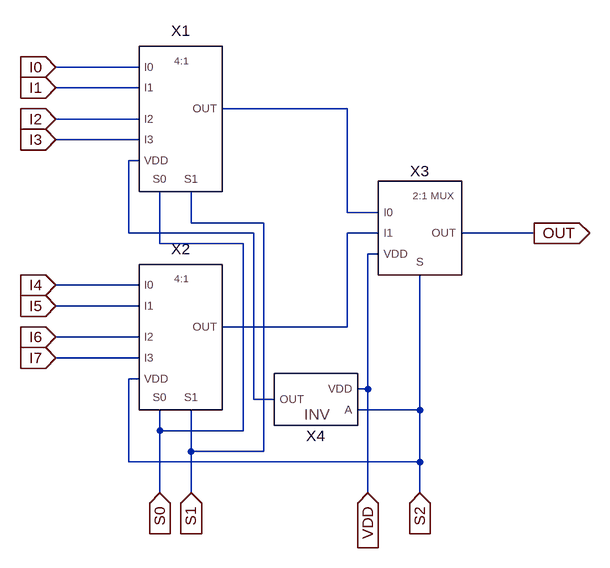
[diagram p0: schematic MUX8to1.asc]
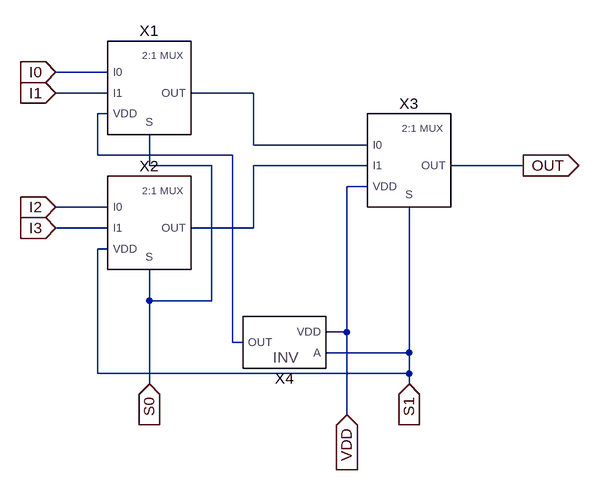
[diagram p1: sub-circuit mux4to1.asc]
MUX8to1.asc, the LTspice schematic file:
Version 4
SHEET 1 880 812
WIRE 112 48 -16 48
WIRE 112 80 -16 80
WIRE 432 112 240 112
WIRE 112 128 -16 128
WIRE 112 160 -16 160
WIRE 112 192 96 192
WIRE 432 272 432 112
WIRE 480 272 432 272
WIRE 192 288 192 240
WIRE 304 288 192 288
WIRE 96 304 96 192
WIRE 288 304 96 304
WIRE 480 304 432 304
WIRE 720 304 608 304
WIRE 144 320 144 240
WIRE 272 320 144 320
WIRE 480 336 464 336
WIRE 112 384 -16 384
WIRE 112 416 -16 416
WIRE 432 448 432 304
WIRE 432 448 240 448
WIRE 112 464 -16 464
WIRE 112 496 -16 496
WIRE 112 528 96 528
WIRE 464 544 464 336
WIRE 464 544 448 544
WIRE 288 560 288 304
WIRE 320 560 288 560
WIRE 544 576 544 368
WIRE 544 576 448 576
WIRE 144 608 144 576
WIRE 272 608 272 320
WIRE 272 608 144 608
WIRE 192 640 192 576
WIRE 304 640 304 288
WIRE 304 640 192 640
WIRE 96 656 96 528
WIRE 544 656 544 576
WIRE 544 656 96 656
WIRE 144 704 144 608
WIRE 192 704 192 640
WIRE 464 704 464 544
WIRE 544 704 544 656
FLAG -16 48 I0
IOPIN -16 48 In
FLAG -16 80 I1
IOPIN -16 80 In
FLAG -16 128 I2
IOPIN -16 128 In
FLAG -16 160 I3
IOPIN -16 160 In
FLAG -16 384 I4
IOPIN -16 384 In
FLAG -16 416 I5
IOPIN -16 416 In
FLAG -16 464 I6
IOPIN -16 464 In
FLAG -16 496 I7
IOPIN -16 496 In
FLAG 144 704 S0
IOPIN 144 704 In
FLAG 192 704 S1
IOPIN 192 704 In
FLAG 544 704 S2
IOPIN 544 704 In
FLAG 464 704 VDD
IOPIN 464 704 In
FLAG 720 304 OUT
IOPIN 720 304 Out
SYMBOL MUX4to1 176 128 R0
SYMATTR InstName X1
SYMBOL MUX4to1 176 464 R0
SYMATTR InstName X2
SYMBOL MUX2to1 544 304 R0
SYMATTR InstName X3
SYMBOL INVgdi 384 560 R180
SYMATTR InstName X4

mux4to1.asc, the sub-circuit schematic file:
Version 4
SHEET 1 880 684
WIRE 96 48 16 48
WIRE 96 80 16 80
WIRE 320 80 224 80
WIRE 96 112 80 112
WIRE 320 160 320 80
WIRE 496 160 320 160
WIRE 80 176 80 112
WIRE 288 176 80 176
WIRE 160 192 160 144
WIRE 256 192 160 192
WIRE 496 192 320 192
WIRE 736 192 624 192
WIRE 496 224 464 224
WIRE 96 256 16 256
WIRE 96 288 16 288
WIRE 320 288 320 192
WIRE 320 288 224 288
WIRE 96 320 80 320
WIRE 160 400 160 352
WIRE 256 400 256 192
WIRE 256 400 160 400
WIRE 464 448 464 224
WIRE 464 448 432 448
WIRE 288 464 288 176
WIRE 304 464 288 464
WIRE 560 480 560 256
WIRE 560 480 432 480
WIRE 80 512 80 320
WIRE 560 512 560 480
WIRE 560 512 80 512
WIRE 160 528 160 400
WIRE 560 528 560 512
WIRE 464 576 464 448
FLAG 16 48 I0
IOPIN 16 48 In
FLAG 16 80 I1
IOPIN 16 80 In
FLAG 16 256 I2
IOPIN 16 256 In
FLAG 16 288 I3
IOPIN 16 288 In
FLAG 736 192 OUT
IOPIN 736 192 Out
FLAG 160 528 S0
IOPIN 160 528 In
FLAG 560 528 S1
IOPIN 560 528 In
FLAG 464 576 VDD
IOPIN 464 576 In
SYMBOL MUX2to1 160 80 R0
SYMATTR InstName X1
SYMBOL MUX2to1 160 288 R0
SYMATTR InstName X2
SYMBOL MUX2to1 560 192 R0
SYMATTR InstName X3
SYMBOL INVgdi 368 464 R180
SYMATTR InstName X4

The netlist it stands for:
* MUX8to1.asc
XX1 I0 I1 I2 I3 S0 S1 N002 N001 mux4to1
XX2 I4 I5 I6 I7 S0 S1 S2 N003 mux4to1
XX3 N001 N003 S2 VDD OUT MUX2to1  ; pins I0 I1 S VDD OUT
XX4 S2 VDD N002 INVgdi  ; pins A VDD OUT

* block symbol definitions
.subckt mux4to1 I0 I1 I2 I3 S0 S1 VDD OUT
XX1 I0 I1 S0 N002 N001 MUX2to1  ; pins I0 I1 S VDD OUT
XX2 I2 I3 S0 S1 N003 MUX2to1  ; pins I0 I1 S VDD OUT
XX3 N001 N003 S1 VDD OUT MUX2to1  ; pins I0 I1 S VDD OUT
XX4 S1 VDD N002 INVgdi  ; pins A VDD OUT
.ends mux4to1

.backanno
.end